# Altium project open-weller-pen.PrjPcb
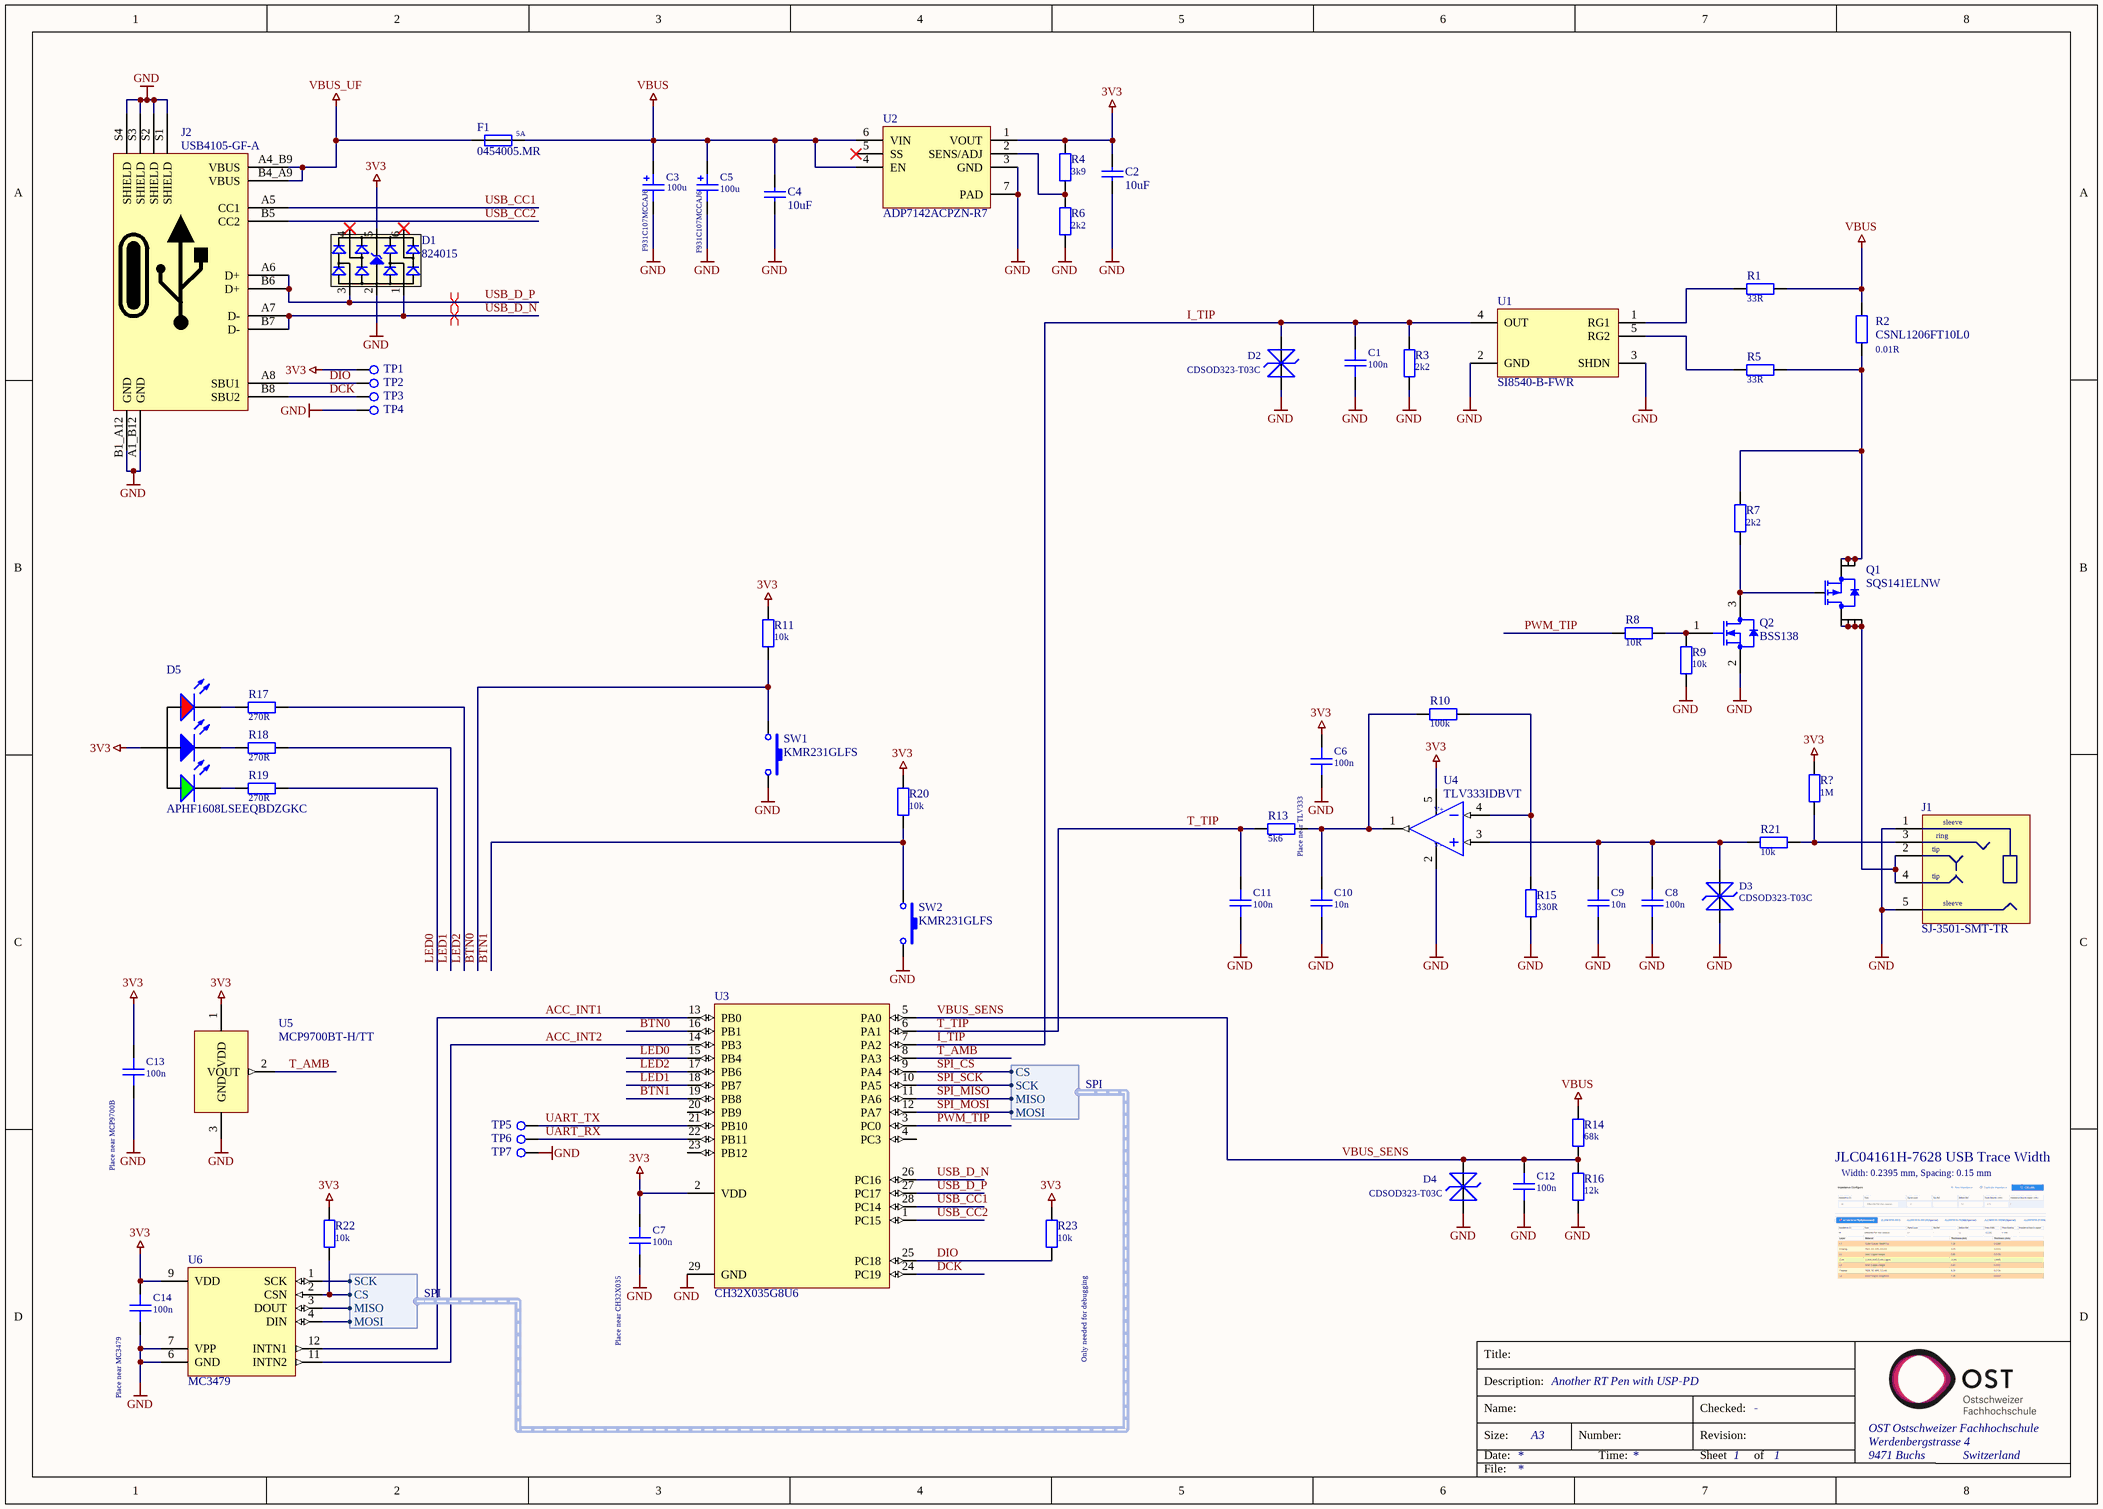
[diagram p0: open-rt-pen.SchDoc]
prj_author: Samuel K.; prj_number: 1; prj_revision: A.1; prj_title: Open Weller Pen
1 sheet, 62 parts. Net scope: global (net labels, ports and power ports of the same name join across sheets).
Board file: open-rt-pen.PcbDoc

## Sheet open-rt-pen.SchDoc: =prj_title
size A3; CheckedBy: -; Author: Samuel K.; CompanyName: OST; Organization: OST Ostschweizer Fachhochschule; Address1: Werdenbergstrasse 4; Address2: 9471 Buchs; Address3: Switzerland; DocumentNumber: 1; Revision: A.1; SheetNumber: 1; SheetTotal: 1; Size: A3; ShortDescription: Another RT Pen with USP-PD

### Parts
C1  value 100n  [Generic_Cap0603_2_R]  (hidden comment: 06035C104kAT2A)
C2  ShortDescription: 10uF  [Generic_Cap0603_2_RW]  (hidden comment: GRM188R61E106KA73D)
C3  F931C107MCCAJ6  value 100u  [Generic_CPOL_C-2312_1P_2N_2]
C4  ShortDescription: 10uF  [Generic_Cap0603_2_RW]  (hidden comment: GRM188R61E106KA73D)
C5  F931C107MCCAJ6  value 100u  [Generic_CPOL_C-2312_1P_2N_2]
C6  value 100n  [Generic_Cap0603_2_R]  (hidden comment: 06035C104kAT2A)
C7  value 100n  [Generic_Cap0603_2_R]  (hidden comment: 06035C104kAT2A)
C8  value 100n  [Generic_Cap0603_2_R]  (hidden comment: 06035C104kAT2A)
C9  value 10n  [Generic_Cap0603_2_R]  (hidden comment: 06035C103kAT2A)
C10  value 10n  [Generic_Cap0603_2_R]  (hidden comment: 06035C103kAT2A)
C11  value 100n  [Generic_Cap0603_2_R]  (hidden comment: 06035C104kAT2A)
C12  value 100n  [Generic_Cap0603_2_R]  (hidden comment: 06035C104kAT2A)
C13  value 100n  [Generic_Cap0603_2_R]  (hidden comment: 06035C104kAT2A)
C14  value 100n  [Generic_Cap0603_2_R]  (hidden comment: 06035C104kAT2A)
D1  824015  [GENERIC_SOT23-6_6_R]
D2  CDSOD323-T03C  [bourns_SOD323_2]
D3  CDSOD323-T03C  [bourns_SOD323_2]
D4  CDSOD323-T03C  [bourns_SOD323_2]
D5  APHF1608LSEEQBDZGKC  [Kingsbright_RGB_LED_0603_RH]
F1  0454005.MR  ShortDescription: 5A  [LITTLEFUSE_045401.5MR_2_R]
J1  SJ-3501-SMT-TR  [CUI_SJ-3501-SMT-TR_5]
J2  USB4105-GF-A  [GCT_USB4105-GF-A_16_R]
Q1  SQS141ELNW  [Vishay_PowerPAK_1212-8_8]
Q2  BSS138  [Generic_SOT23_3_RWH]
R1  value 33R  [Generic_Res0603_2_RW]  (hidden comment: RC0603FR-0733RL)
R2  CSNL1206FT10L0  value 0.01R  [Generic_Res1206_2_RW]
R3  value 2k2  [Generic_Res0603_2_RW]  (hidden comment: RC0603FR-072K2L)
R4  value 3k9  [Generic_Res0603_2_RW]  (hidden comment: RC0603FR-073K9L)
R5  value 33R  [Generic_Res0603_2_RW]  (hidden comment: RC0603FR-0733RL)
R6  value 2k2  [Generic_Res0603_2_RW]  (hidden comment: RC0603FR-072K2L)
R7  value 2k2  [Generic_Res0603_2_RW]  (hidden comment: RC0603FR-072K2L)
R8  value 10R  [Generic_Res0603_2_RW]  (hidden comment: RC0603FR-0710RL)
R9  value 10k  [Generic_Res0603_2_RW]  (hidden comment: RC0603FR-0710KL)
R10  value 100k  [Generic_Res0603_2_RW]  (hidden comment: RC0603FR-07100KL)
R11  value 10k  [Generic_Res0603_2_RW]  (hidden comment: RC0603FR-0710KL)
R13  value 5k6  [Generic_Res0603_2_RW]  (hidden comment: RC0603FR-075K6L)
R14  value 68k  [Generic_Res0603_2_RW]  (hidden comment: RC0603FR-0768KL)
R15  value 330R  [Generic_Res0603_2_RW]  (hidden comment: RC0603FR-07330RL)
R16  value 12k  [Generic_Res0603_2_RW]  (hidden comment: RC0603FR-0712KL)
R17  value 270R  [Generic_Res0603_2_RW]  (hidden comment: RC0603FR-07270RL)
R18  value 270R  [Generic_Res0603_2_RW]  (hidden comment: RC0603FR-07270RL)
R19  value 270R  [Generic_Res0603_2_RW]  (hidden comment: RC0603FR-07270RL)
R20  value 10k  [Generic_Res0603_2_RW]  (hidden comment: RC0603FR-0710KL)
R21  value 10k  [Generic_Res0603_2_RW]  (hidden comment: RC0603FR-0710KL)
R22  value 10k  [Generic_Res0603_2_RW]  (hidden comment: RC0603FR-0710KL)
R23  value 10k  [Generic_Res0603_2_RW]  (hidden comment: RC0603FR-0710KL)
R?  value 1M  [Generic_Res0603_2_RW]  (hidden comment: RC0603FR-071ML)
SW1  KMR231GLFS  [CK_KMR231GLFS_4]
SW2  KMR231GLFS  [CK_KMR231GLFS_4]
TP1  Testpoint 1.5mm  [Generic_SolderPad-1.5x1.5R_1_H]  (value not drawn)
TP2  Testpoint 1.5mm  [Generic_SolderPad-1.5x1.5R_1_H]  (value not drawn)
TP3  Testpoint 1.5mm  [Generic_SolderPad-1.5x1.5R_1_H]  (value not drawn)
TP4  Testpoint 1.5mm  [Generic_SolderPad-1.5x1.5R_1_H]  (value not drawn)
TP5  Testpoint 1.5mm  [Generic_SolderPad-1.5x1.5R_1_H]  (value not drawn)
TP6  Testpoint 1.5mm  [Generic_SolderPad-1.5x1.5R_1_H]  (value not drawn)
TP7  Testpoint 1.5mm  [Generic_SolderPad-1.5x1.5R_1_H]  (value not drawn)
U1  SI8540-B-FWR  [GENERIC_SOT23-5_5_R]
U2  ADP7142ACPZN-R7  [ANALOG_LFCSP6_7_R]
U3  CH32X035G8U6  [WCH_QFN28_29]
U4  TLV333IDBVT  [TI_SOT23_5_RH]
U5  MCP9700BT-H/TT  [Generic_SOT23_3_R]
U6  MC3479  [MEMSIC_MC3479_LGA12_12_R]

### Harnesses
SPI: CS, SCK, MISO, MOSI

### Nets
3V3: C2.2 C6.2 C7.2 C13.2 C14.2 D1.5(VDD) D5.1(A) R4.1 R11.1 R20.1 R22.2 R23.2 R?.1 TP1.1(TP) U2.1(VOUT) U3.2(VDD) U4.5(V+) U5.1(VDD) U6.9(VDD)
GND: C1.1 C2.1 C3.2 C4.1 C5.2 C6.1 C7.1 C8.1 C9.1 C10.1 C11.1 C12.1 C13.1 C14.1 D1.2(GND) D2.2(A) D3.2(A) D4.2(A) J1.1(sleeve) J1.5(sleeve) J2.A1_B12(GND) J2.B1_A12(GND) J2.S1(SHIELD) J2.S2(SHIELD) J2.S3(SHIELD) J2.S4(SHIELD) Q2.2(S) R3.2 R6.2 R9.2 R15.1 R16.2 SW1.1 SW2.1 TP4.1(TP) TP7.1(TP) U1.2(GND) U1.3(SHDN) U2.3(GND) U2.7(PAD) U3.29(GND) U4.2(V-) U5.3(GND) U6.6(GND) U6.7(VPP)
VBUS: C3.1 C4.2 C5.1 F1.2 R1.2 R2.1 R14.1 U2.4(EN) U2.6(VIN)
VBUS_UF: F1.1 J2.A4_B9(VBUS) J2.B4_A9(VBUS)
ACC_INT1: U3.13(PB0) U6.12(INTN1)
ACC_INT2: U3.14(PB3) U6.11(INTN2)
BTN0: R11.2 SW1.2 U3.16(PB1)
BTN1: R20.2 SW2.2 U3.19(PB8)
DCK: J2.B8(SBU2) TP3.1(TP) U3.24(PC19)
DIO: J2.A8(SBU1) R23.1 TP2.1(TP) U3.25(PC18)
I_TIP: C1.2 D2.1(K) R3.1 U1.4(OUT) U3.7(PA2)
LED0: R19.1 U3.15(PB4)
LED1: R18.1 U3.18(PB7)
LED2: R17.1 U3.17(PB6)
PWM_TIP: R8.1 U3.3(PC0)
SPI_CS: R22.1 U3.9(PA4) U6.2(CSN) ; harness SPI.CS
SPI_MISO: U3.11(PA6) U6.3(DOUT) ; harness SPI.MISO
SPI_MOSI: U3.12(PA7) U6.4(DIN) ; harness SPI.MOSI
SPI_SCK: U3.10(PA5) U6.1(SCK) ; harness SPI.SCK
T_AMB: U3.8(PA3) U5.2(VOUT)
T_TIP: C11.2 R13.1 U3.6(PA1)
UART_RX: TP6.1(TP) U3.22(PB11)
UART_TX: TP5.1(TP) U3.21(PB10)
USB_CC1: J2.A5(CC1) U3.28(PC14)
USB_CC2: J2.B5(CC2) U3.1(PC15)
USB_D_N: D1.1(I/O1) J2.A7(D-) J2.B7(D-) U3.26(PC16)
USB_D_P: D1.3(I/O2) J2.A6(D+) J2.B6(D+) U3.27(PC17)
VBUS_SENS: C12.2 D4.1(K) R14.2 R16.1 U3.5(PA0)
NetC8_2: C8.2 C9.2 D3.1(K) R21.2 U4.3(IN+)
NetC10_2: C10.2 R10.2 R13.2 U4.1(OUT)
NetD5_2: D5.2(KR) R17.2
NetD5_3: D5.3(KB) R18.2
NetD5_4: D5.4(KG) R19.2
NetJ1_2: J1.2(tip) J1.4(tip) Q1.5(D) Q1.6(D) Q1.7(D) Q1.8(D)
NetJ1_3: J1.3(ring) R21.1 R?.2
NetQ1_1: Q1.1(S) Q1.2(S) Q1.3(S) R2.2 R5.2 R7.1
NetQ1_4: Q1.4(G) Q2.3(D) R7.2
NetQ2_1: Q2.1(G) R8.2 R9.1
NetR1_1: R1.1 U1.1(RG1)
NetR4_2: R4.2 R6.1 U2.2(SENS/ADJ)
NetR5_1: R5.1 U1.5(RG2)
NetR10_1: R10.1 R15.2 U4.4(IN-)

Not connected (* = marked no-connect by the designer): D1 4(I/O3)* 6(I/O4)*; U2 5(SS)*; U3 4(PC3) 20(PB9) 23(PB12)

### Layout directives
differential pair; net class USB: USB_D_N, USB_D_P

### Notes on the sheet
- (near C6) Place near TLV333
- (near C13) Place near MCP9700B
- JLC04161H-7628 USB Trace Width
- Width: 0.2395 mm, Spacing: 0.15 mm
- (near C7) Place near CH32X035
- (near R23) Only needed for debugging
- (near C14) Place near MC3479
- Title:
- Description:
- Size:
- Date:
- Name:
- Number:
- Time:
- Revision:
- Sheet
- Checked:
- of
- File:

### Library data of the parts
C1 C6-C8 C11-C14 = KYOCERA_AVX_X7R-DIELECTRIC-0000-A.1: 100n, X7R, 10%, 50V, 0603; Manufacturer: Kyocera AVX; ShortDescription: 100n; Manufacturer PartNr: 06035C104kAT2A
C2 C4 = Baugruppenfertigung-0041-A.5: 10uF, X5R, 10%, 25V; Manufacturer: Murata; Manufacturer PartNr: GRM188R61E106KA73D
C3 C5 = KRSA-0126-A.1: 100u, TANTAL, 20%, 16V, C(2312); Manufacturer: AVX; ShortDescription: 100u; Manufacturer PartNr: F931C107MCCAJ6
C9 C10 = KYOCERA_AVX_X7R-DIELECTRIC-0001-A.2: 10n, X7R, 10%, 50V, 0603; Manufacturer: Kyocera AVX; ShortDescription: 10n; Manufacturer PartNr: 06035C103kAT2A
D1 = KRSA-0098-A.1: TVS Diode Array, 5V, Unidirectional; Manufacturer: Wurth; ShortDescription: 824015; Manufacturer PartNr: 824015
D2-D4 = 4.6520.059.01_Hilti_Rebar_Detector-0042-A.1: TVS Diode, bidirectional, 3V3, 1pF; Manufacturer: bourns; ShortDescription: T03C; Manufacturer PartNr: CDSOD323-T03C
D5 = Component-00142-A.1: LED RGB 0603 SMD; Manufacturer: Kingsbright; ShortDescription: Description (used in sheet); Manufacturer PartNr: APHF1608LSEEQBDZGKC
F1 = 4.6520.020_Palindrome_RTSDrone-0335-A.1: Nano Slo-Blo, Surface Mount Fuse, 5A; Manufacturer: Littlefuse; Manufacturer PartNr: 0454005.MR
J1 = KRSA-0117-A.1: Audio Jack, 3.5mm, Mid Mount; Manufacturer: CUI; Manufacturer PartNr: SJ-3501-SMT-TR; ShortDescription: SJ-3501-SMT-TR
J2 = KRSA-0082-A.1: USB Type C, Edge Mount, USB 2.0; Manufacturer: GCT; ShortDescription: USB-C; Manufacturer PartNr: USB4105-GF-A
Q1 = KRSA-0111-A.1: MOSFET, P-Ch, 40V, 100A; Manufacturer: Vishay; ShortDescription: SQS141ELNW; Manufacturer PartNr: SQS141ELNW
Q2 = 00000_Hilti_Localisation_MA-0139-A.4: MOSFET, N-Ch, 50V, 220mA; Manufacturer: ON; ShortDescription: BSS138; Manufacturer PartNr: BSS138
R1 R5 = YAEGO_RC0603FR-07-0019-A.2: 33R, 1%, 0.1W, 0603; Manufacturer: YAGEO; ShortDescription: 33R; Manufacturer PartNr: RC0603FR-0733RL
R2 = KRSA-0128-A.1: 0.01R, Shunt, 1W, 1%, 1206; Manufacturer: Stackpole Electronics Inc; ShortDescription: 0.01R; Manufacturer PartNr: CSNL1206FT10L0
R3 R6 R7 = YAEGO_RC0603FR-07-0041-A.2: 2k2, 1%, 0.1W, 0603; Manufacturer: YAGEO; Manufacturer PartNr: RC0603FR-072K2L; ShortDescription: 2k2
R4 = YAEGO_RC0603FR-07-0044-A.1: 3k9, 1%, 0.1W, 0603; Manufacturer: YAGEO; Manufacturer PartNr: RC0603FR-073K9L; ShortDescription: 3k9
R8 = YAEGO_RC0603FR-07-0013-A.2: 10R, 1%, 0.1W, 0603; Manufacturer: YAGEO; ShortDescription: 10R; Manufacturer PartNr: RC0603FR-0710RL
R9 R11 R20-R23 = YAEGO_RC0603FR-07-0049-A.1: 10k, 1%, 0.1W, 0603; Manufacturer: YAGEO; ShortDescription: 10k; Manufacturer PartNr: RC0603FR-0710KL
R10 = YAEGO_RC0603FR-07-0061-A.1: 100k, 1%, 0.1W, 0603; Manufacturer: YAGEO; ShortDescription: 100k; Manufacturer PartNr: RC0603FR-07100KL
R13 = YAEGO_RC0603FR-07-0046-A.1: 5k6, 1%, 0.1W, 0603; Manufacturer: YAGEO; Manufacturer PartNr: RC0603FR-075K6L; ShortDescription: 5k6
R14 = YAEGO_RC0603FR-07-0059-A.1: 68k, 1%, 0.1W, 0603; Manufacturer: YAGEO; ShortDescription: 68k; Manufacturer PartNr: RC0603FR-0768KL
R15 = YAEGO_RC0603FR-07-0031-A.2: 330R, 1%, 0.1W, 0603; Manufacturer: YAGEO; Manufacturer PartNr: RC0603FR-07330RL; ShortDescription: 330R
R16 = YAEGO_RC0603FR-07-0050-A.1: 12k, 1%, 0.1W, 0603; Manufacturer: YAGEO; Manufacturer PartNr: RC0603FR-0712KL; ShortDescription: 12k
R17-R19 = YAEGO_RC0603FR-07-0030-A.2: 270R, 1%, 0.1W, 0603; Manufacturer: YAGEO; Manufacturer PartNr: RC0603FR-07270RL; ShortDescription: 270R
R? = YAEGO_RC0603FR-07-0073-A.1: 1M, 1%, 0.1W, 0603; Manufacturer: YAGEO; Manufacturer PartNr: RC0603FR-071ML; ShortDescription: 1M
SW1 SW2 = 10707_OST_EuR2_Projekt-0018-A.1: Tactile Switch, Thin Type; Manufacturer: CK; Manufacturer PartNr: KMR231GLFS; ShortDescription: KMR231GLFS
TP1-TP7 = KRSA-0230-A.1: Testpoint, round, 1.5mm; Manufacturer: Generic; Manufacturer PartNr: -; ShortDescription: Testpoin
U1 = KRSA-0131-A.1: High-side Current Sense Amplifier; Manufacturer: Skyworks; ShortDescription: SI8540; Manufacturer PartNr: SI8540-B-FWR
U2 = KRSA-0055-A.2: 40 V, 200 mA, Low Noise, ADJ CMOS LDO Linear Regulator; Manufacturer: Analog; Manufacturer PartNr: ADP7142ACPZN-R7; ShortDescription: ADP7142
U3 = KRSA-0178-A.3: WCH CH32, USB, USB-PD, I2C, SPI, UART, OPA, CMP, ADC, TOUCH; Manufacturer PartNr: CH32X035G8U6; ShortDescription: CH32X035G8U6; Manufacturer: WCH
U4 = KRSA-0108-A.1: 350kHz GBW, Low Noise, Zero Drift, 5.5V; Manufacturer: TI; ShortDescription: TLV333; Manufacturer PartNr: TLV333IDBVT
U5 = KRSA-0242-A.1: Temperature Sensor, Analog, +/- 1°C, SOT23; Manufacturer: Microchip; Manufacturer PartNr: MCP9700BT-H/TT; ShortDescription: MCP9700BT-H/TT
U6 = KRSA-0245-A.1: 3-Axis Accelerometer; Manufacturer: MEMSIC; Manufacturer PartNr: MC3479; ShortDescription: MC3479

## Assembly variants
Default: not fitted R?